# EAGLE design Adafruit 1.9in 320x170 Color IPS TFT (EAGLE 9.6.2)
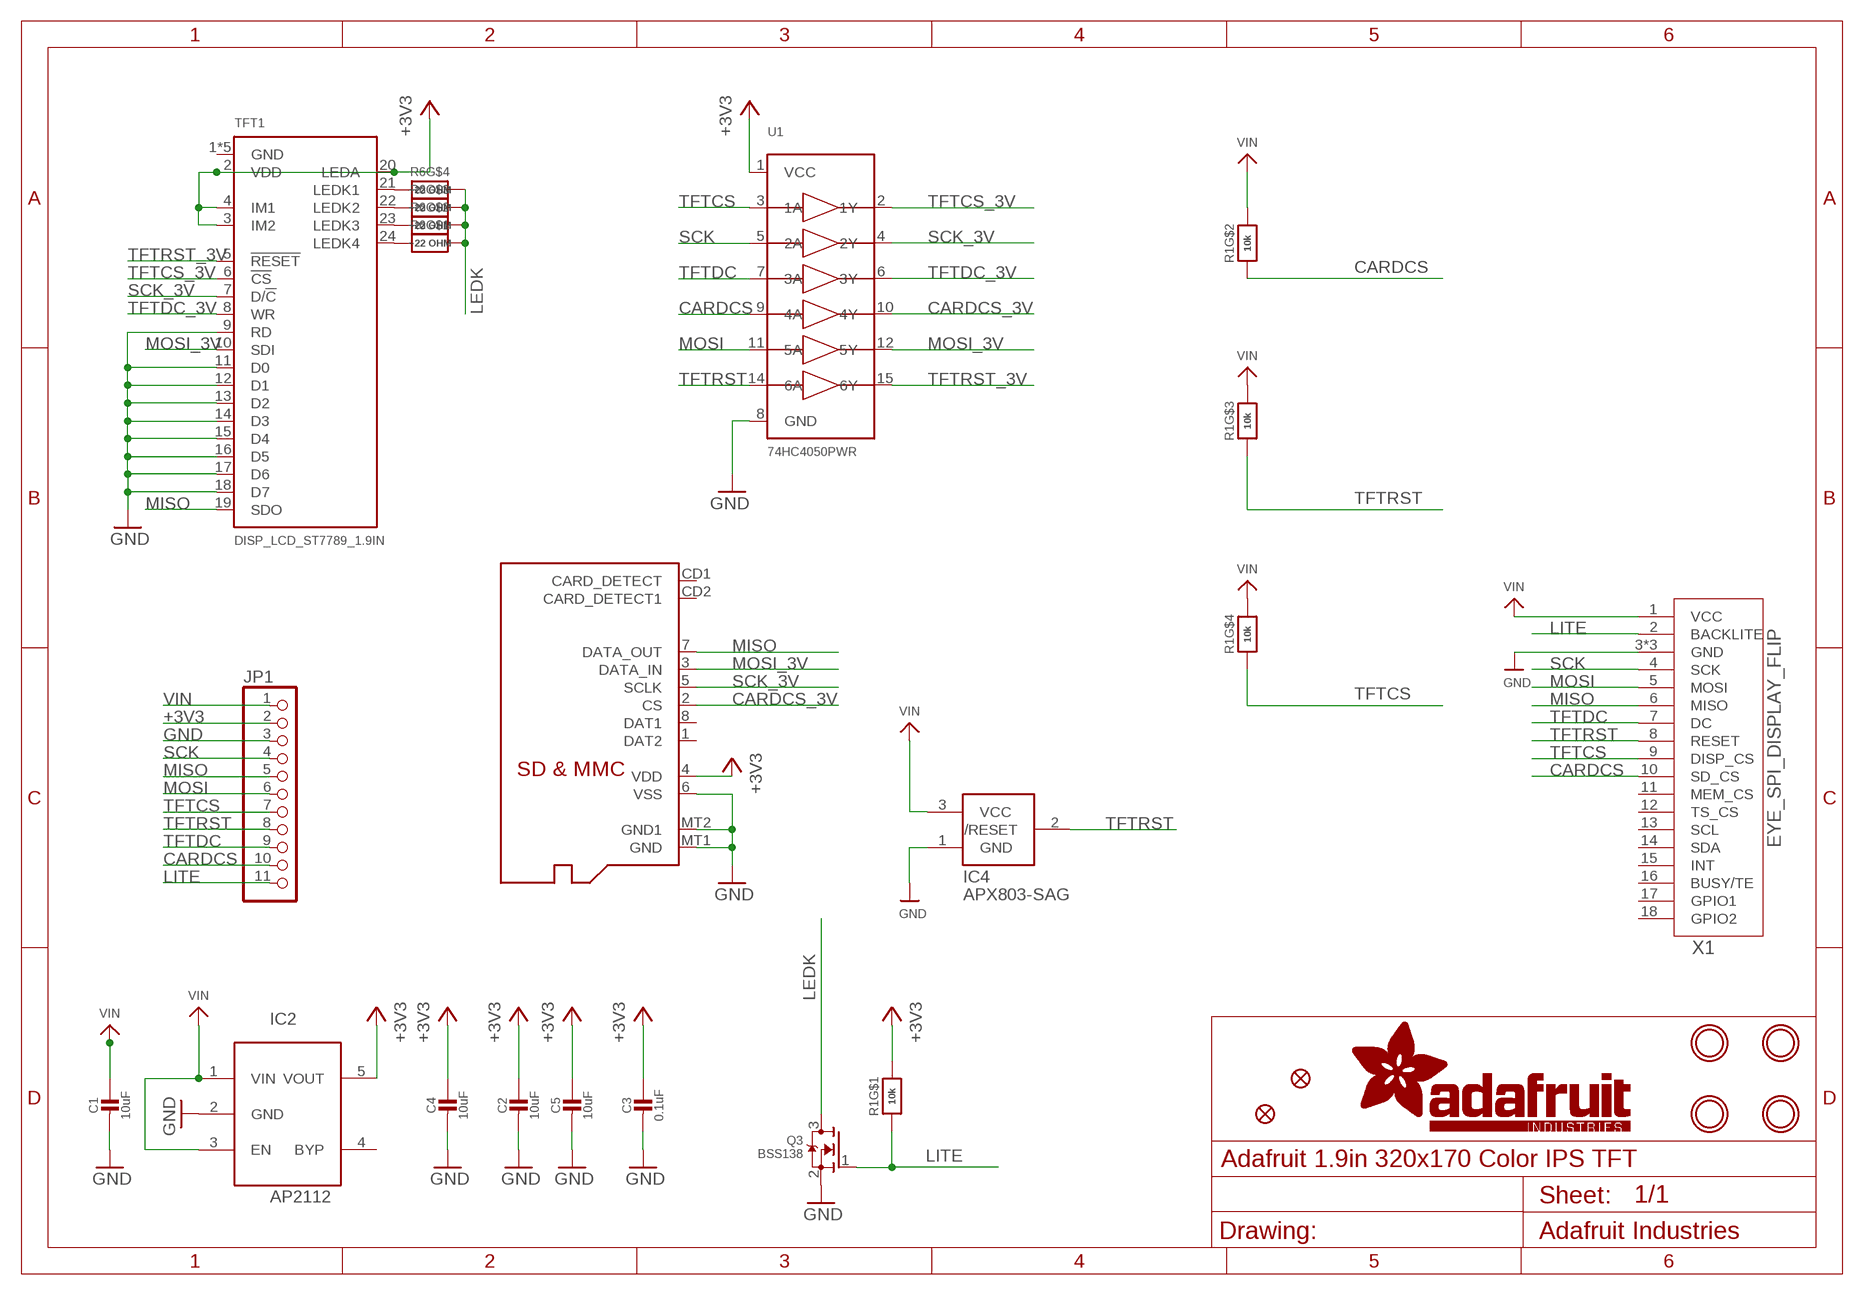
[diagram p0: schematic, sheet 1]

## Parts
C1  10uF  CAP_CERAMIC0805-NOOUTLINE  [0805-NO]
C2  10uF  CAP_CERAMIC0805-NOOUTLINE  [0805-NO]
C3  0.1uF  CAP_CERAMIC0603_NO  [0603-NO]
C4  10uF  CAP_CERAMIC0805-NOOUTLINE  [0805-NO]
C5  10uF  CAP_CERAMIC0805-NOOUTLINE  [0805-NO]
IC2  AP2112  LP298XS  [SOT23-5L]
IC4  APX803-SAG  AXP083-SAG  [SOT23]
JP1  HEADER-1X1176MIL  [1X11_ROUND_76]
Q2  MICROSD  [MICROSD]
Q3  BSS138  MOSFET-NWIDE  [SOT23-WIDE]
R1  10k  RESISTOR_4PACK  [RESPACK_4X0603]
R6  ~22 OHM  RESISTOR_4PACK  [RESPACK_4X0603]
TFT1  DISP_LCD_ST7789_1.9IN  [TFT_1.9IN_170X320_30P]
U1  74HC4050PWR  74HC4050DTSSOP  [TSSOP16]
U$4  FIDUCIAL_1MM  [FIDUCIAL_1MM]
U$5  FIDUCIAL_1MM  [FIDUCIAL_1MM]
U$7  MOUNTINGHOLE2.5  [MOUNTINGHOLE_2.5_PLATED]
U$8  MOUNTINGHOLE2.5  [MOUNTINGHOLE_2.5_PLATED]
U$9  MOUNTINGHOLE2.5  [MOUNTINGHOLE_2.5_PLATED]
U$10  MOUNTINGHOLE2.5  [MOUNTINGHOLE_2.5_PLATED]
X1  EYE_SPI_DISPLAY_FLIP  [EYE_SPI_DISPLAY_BOTCONTACT]

## Nets
+3V3 [power]: C2.1 C3.1 C4.1 C5.1 IC2.5(VOUT) JP1.2 Q2.4(VDD) R1.8 TFT1.2(VDD) TFT1.3(IM2) TFT1.4(IM1) TFT1.20(LEDA) U1.1(VCC)
CARDCS: JP1.10 R1.2 U1.9(4A) X1.10(SD_CS)
CARDCS_3V: Q2.2(CS) U1.10(4Y)
GND: C1.2 C2.2 C3.2 C4.2 C5.2 IC2.2(GND) IC4.1(GND) JP1.3 Q2.6(VSS) Q2.MT1(GND) Q2.MT2(GND1) Q3.2(S) TFT1.9(RD) TFT1.11(D0) TFT1.12(D1) TFT1.13(D2) TFT1.14(D3) TFT1.15(D4) TFT1.16(D5) TFT1.17(D6) TFT1.18(D7) U1.8(GND) X1.3(GND) X1.SUPPORT1(GND) X1.SUPPORT2(GND)
LEDK: Q3.3(D) R6.5 R6.6 R6.7 R6.8
LITE: JP1.11 Q3.1(G) R1.1 X1.2(BACKLITE)
MISO: JP1.5 Q2.7(DATA_OUT) TFT1.19(SDO) X1.6(MISO)
MOSI: JP1.6 U1.11(5A) X1.5(MOSI)
MOSI_3V: Q2.3(DATA_IN) TFT1.10(SDI) U1.12(5Y)
N$2: R6.4 TFT1.21(LEDK1)
N$3: R6.3 TFT1.22(LEDK2)
N$4: R6.2 TFT1.23(LEDK3)
N$5: R6.1 TFT1.24(LEDK4)
SCK: JP1.4 U1.5(2A) X1.4(SCK)
SCK_3V: Q2.5(SCLK) TFT1.7(D/!C) U1.4(2Y)
TFTCS: JP1.7 R1.4 U1.3(1A) X1.9(DISP_CS)
TFTCS_3V: TFT1.6(!CS) U1.2(1Y)
TFTDC: JP1.9 U1.7(3A) X1.7(DC)
TFTDC_3V: TFT1.8(WR) U1.6(3Y)
TFTRST: IC4.2(/RESET) JP1.8 R1.3 U1.14(6A) X1.8(RESET)
TFTRST_3V: TFT1.5(!RESET) U1.15(6Y)
VIN [power]: C1.1 IC2.1(VIN) IC2.3(EN) IC4.3(VCC) JP1.1 R1.5 R1.6 R1.7 X1.1(VCC)
Unconnected: IC2.4(BYP) Q2.1(DAT2) Q2.8(DAT1) Q2.CD1(CARD_DETECT) Q2.CD2(CARD_DETECT1) X1.11(MEM_CS) X1.12(TS_CS) X1.13(SCL) X1.14(SDA) X1.15(INT) X1.16(BUSY/TE) X1.17(GPIO1) X1.18(GPIO2)

## Power pins joined to a net without a drawn wire
GND: TFT1.1(GND) TFT1.25(GND) TFT1.30(GND) TFT1.MNT1(GND) TFT1.MNT2(GND)

## Library data of the parts
C1-C5 = microbuilder:CAP_CERAMIC: Ceramic Capacitors For new designs, use the packages preceded by an '_' character since they are more reliable: The following footprints should be used on most boards: _0402 - Standard footprint for regular board layouts _0603 - Standard footprint for regular board layouts _0805 - Standard footprint for regular board layouts _1206 - Standard footprint for regular board layouts For extremely tight-pitch boards where space is at a premium, the following 'micro-pitch' footprints can be used (smaller pads, no silkscreen outline, etc.): _0402MP - Micro-pitch footprint for very dense/compact boards _0603MP - Micro-pitch footprint for very dense/compact boards _0805MP - Micro-pitch footprint for very dense/compact boards _1206MP - Micro-pitch footprint for very dense/compact boards
IC2 = adafruit:LP298X
IC4 = adafruit:AXP083
JP1 = microbuilder:HEADER-1X11
Q2 = adafruit:MICROSD: Micro-SD / Transflash card holder with SPI pinout For the 3M # 2908-05WB-MG and/or 4UCON #19656 push-push type
Q3 = microbuilder:MOSFET-N: N-Channel Mosfet LEGEND VDS: Voltage Drain-Source ID: Drain Current RDS(ON): Drain-Source On-State Resistance VGS(TH): Gate-Source Threshold Voltage CISS: Drain-Source Input Capacitance SOT-23 Name VDS ID RDS(ON) VGS(TH) CISS Order Number 2N7002E 60V 260mA 2.5 Ohm 2.5V @ 250uA 26.7pF @ 25V 2N7002ET1GOSTR-ND BSH103 30V 850mA 400 mOhm 400mV @ 1mA 83pF @ 24V BSH103,235-ND BSS138 60V 320mA 1.6 Ohm 1.5V @ 250uA 50pF @ 10V Mouser: 771-BSS138PW115 DMN2075U-7 20V 4.2A 38 mOhm 1V @ 250 uA 594.3pF @ 10V DMN2075U-7DICT-ND * BSS138 good choice for I2C level-shifting POWERPAK 1212-8 Name VDS ID RDS(ON) VGS(TH) CISS Order Number Si7308DN 60V 6A 58 mOhm 3V @ 250uA 665pF @ 15V SI7308DN-T1-E3CT-ND
R1 R6 = microbuilder:RESISTOR_4PACK: Resistor Packs (4 resistors) 4 x 0603 10K 1/16W - Digikey: YC164J-10KCT-ND
TFT1 = adafruit_display:DISP_LCD_ST7789_1.9IN
U1 = microbuilder:74HC4050D: 6-channel level shifter 74HC4050D - 2V-6V Supply SOIC16 Digikey: 74HC4050D,653-ND Mouser: 771-74HC4050D-T TSSOP16 Digikey: 296-9215-1-ND Mouser:
U$4 U$5 = microbuilder:FIDUCIAL: Fiducial Alignment Points Various fiducial points for machine vision alignment.; BOM: EXCLUDE
U$7-U$10 = microbuilder:MOUNTINGHOLE: Mounting Hole For #2 screws (0.086"/2.18mm width, 0.094"/2.4mm hole) use 2.5mm; BOM: EXCLUDE
X1 = adafruit_display:EYE_SPI_DISPLAY

## Net classes
1 power: width 0.254 mm

## Board
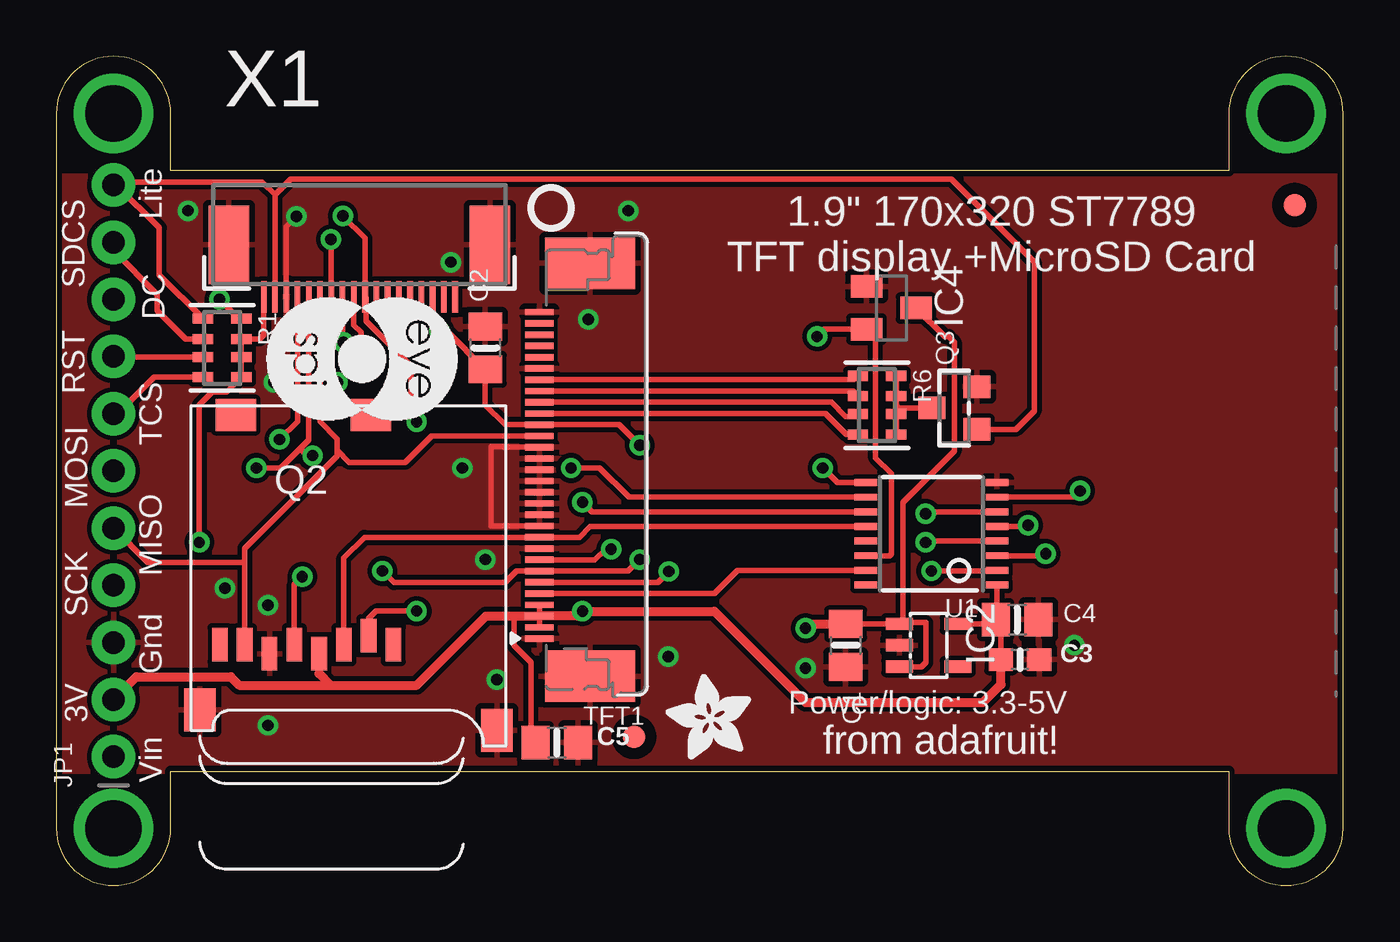
[diagram p1: board, top side]
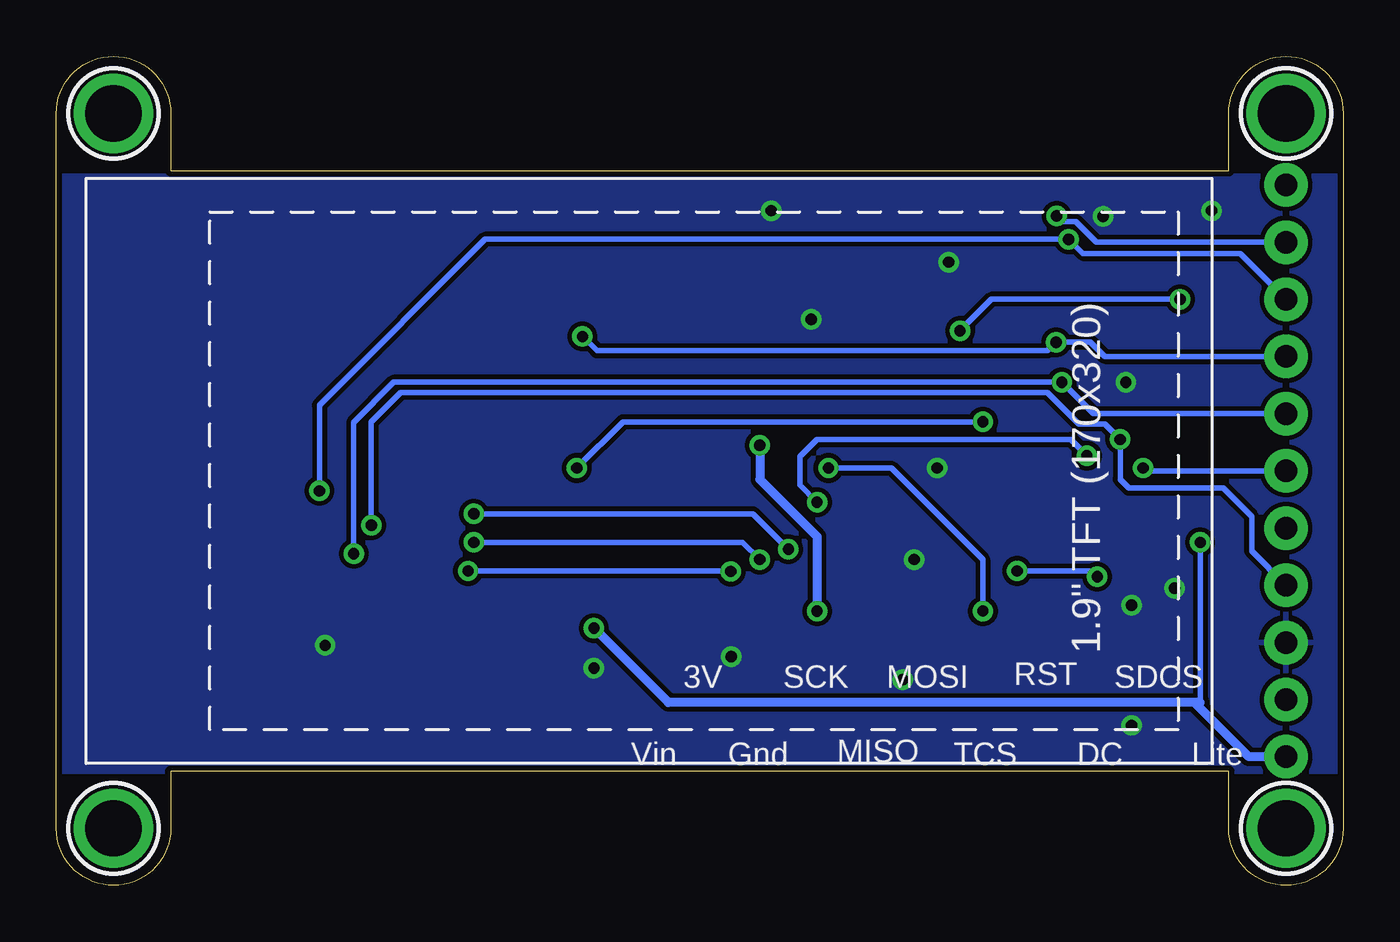
[diagram p2: board, bottom side, seen from below]

Size 57.15 x 36.83 mm. Coordinates in mm from the lower left corner, seen from the top.
Outline: 54.61,36.83 arc90 52.07,34.29 52.07,31.75 5.08,31.75 5.08,34.29 arc90 2.54,36.83 arc90 0,34.29 0,2.54 arc90 2.54,0 arc90 5.08,2.54 5.08,5.08 52.07,5.08 52.07,2.54 arc90 54.61,0 arc90 57.15,2.54 57.15,34.29 arc90 54.61,36.83
Copper layers (1*16): Top 0.035mm / dielectric 1.5mm / Bottom 0.035mm
Design rules "adafruit *": minimum track width 8mil, minimum drill 15.5mil, track to track 8mil, track to pad 8mil, pad to pad 8mil, via to via 8mil, smd to smd 8mil, copper to edge 10mil, drill to drill 8mil, minimum pad ring 10mil, minimum via ring 8mil, stop-mask expansion 2mil, vias tented up to drill 20mil, thermal gap 10mil

### Footprints (pad centres in the part's own frame; a part is rotated, then mirrored left to right if it is on the bottom)
0805-NO = smd 1.24 x 1.5: 1 -0.95,0; 2 0.95,0
0603-NO = smd 1.075 x 1: 1 -0.85,0; 2 0.85,0
SOT23-5L = smd 0.55 x 1.2: 1 -0.95,-1.3; 2 0,-1.3; 3 0.95,-1.3; 4 0.95,1.3; 5 -0.95,1.3
SOT23 = smd 1 x 1.4: 1 -0.95,-1.1; 2 0.95,-1.1; 3 0,1.1
1X11_ROUND_76 = drill 1 pad 1.93: 1 -12.7,0; 2 -10.16,0; 3 -7.62,0; 4 -5.08,0; 5 -2.54,0; 6 0,0; 7 2.54,0; 8 5.08,0; 9 7.62,0; 10 10.16,0; 11 12.7,0
MICROSD = smd 0.7 x 1.5: 1 9,-10.64; 2 7.9,-10.24; 3 6.8,-10.64; 4 5.7,-11.04; 5 4.6,-10.64; 6 3.5,-11.04; 7 2.4,-10.64; 8 1.3,-10.64 | smd 1.8 x 1.4: CD1 2,-0.44; CD2 8,-0.44 | smd 1.4 x 1.9: MT1 0.4,-13.54; MT2 13.6,-14.44
SOT23-WIDE = smd 1 x 1.2: 1 -0.95,-1; 2 0.95,-1; 3 0,1
RESPACK_4X0603 = smd 0.45 x 0.9: 1 -1.3,-0.85; 2 -0.4,-0.85; 3 0.4,-0.85; 4 1.3,-0.85; 5 1.3,0.85; 6 0.4,0.85; 7 -0.4,0.85; 8 -1.3,0.85
TFT_1.9IN_170X320_30P = smd 0.28 x 1.25: 1 -7.45,7.378; 2 -6.95,7.378; 3 -6.45,7.378; 4 -5.95,7.378; 5 -5.45,7.378; 6 -4.95,7.378; 7 -4.45,7.378; 8 -3.95,7.378; 9 -3.45,7.378; 10 -2.95,7.378; 11 -2.45,7.378; 12 -1.95,7.378; 13 -1.45,7.378; 14 -0.95,7.378; 15 -0.45,7.378; 16 0.05,7.378; 17 0.55,7.378; 18 1.05,7.378; 19 1.55,7.378; 20 2.05,7.378; 21 2.55,7.378; 22 3.05,7.378; 23 3.55,7.378; 24 4.05,7.378; 25 4.55,7.378; 26 5.05,7.378; 27 5.55,7.378; 28 6.05,7.378; 29 6.55,7.378; 30 7.05,7.378 | smd 2.3 x 4: MNT1 -9.12,5.122; MNT2 9.22,5.122
TSSOP16 = smd 0.305 x 0.991: 1 -2.275,-2.918; 2 -1.625,-2.918; 3 -0.975,-2.918; 4 -0.325,-2.918; 5 0.325,-2.918; 6 0.975,-2.918; 7 1.625,-2.918; 8 2.275,-2.918; 9 2.275,2.918; 10 1.625,2.918; 11 0.975,2.918; 12 0.325,2.918; 13 -0.325,2.918; 14 -0.975,2.918; 15 -1.625,2.918; 16 -2.275,2.918
FIDUCIAL_1MM = smd 1 x 1: 1 0,0
MOUNTINGHOLE_2.5_PLATED = drill 2.5 pad 3.2: P$1 0,0
EYE_SPI_DISPLAY_BOTCONTACT = smd 0.25 x 1.4: 1 -4.25,-2.678; 2 -3.75,-2.678; 3 -3.25,-2.678; 4 -2.75,-2.678; 5 -2.25,-2.678; 6 -1.75,-2.678; 7 -1.25,-2.678; 8 -0.75,-2.678; 9 -0.25,-2.678; 10 0.25,-2.678; 11 0.75,-2.678; 12 1.25,-2.678; 13 1.75,-2.678; 14 2.25,-2.678; 15 2.75,-2.678; 16 3.25,-2.678; 17 3.75,-2.678; 18 4.25,-2.678 | smd 1.8 x 3.5: SUPPORT1 5.8,-0.372; SUPPORT2 -5.8,-0.372

### Placement (x,y rotation side)
C1  35.05,10.67 270 top
C2  19.05,23.88 90 top
C3  42.8,10.03 0 top
C4  42.67,11.81 0 top
C5  22.23,6.35 0 top
IC2  38.73,10.67 270 top
IC4  37.08,25.65 270 top
JP1  2.54,18.41 90 top
Q2  5.97,21.34 0 top
Q3  39.88,21.21 90 top
R1  7.37,23.88 270 top
R6  36.45,21.34 270 top
TFT1  28.83,18.41 90 top
U1  38.86,15.62 90 top
U$2  [PCBFEAT-REV-040]  21.97,30.1 180 top
U$4  54.99,30.23 180 top
U$5  25.65,6.6 270 top
U$7  54.61,2.54 0 bottom
U$8  54.61,34.29 0 bottom
U$9  2.54,2.54 0 bottom
U$10  2.54,34.29 0 bottom
U$21  [ADAFRUIT_3.5MM]  30.86,5.59 90 top
U$22  [EYESPI_MINI_LOGO]  9.27,26.16 270 top
X1  13.46,28.83 0 top

### Tracks (layer width: path | path; a pad name or v marks a point on that pad's centre or on a via)
+3V3  (via drill 0.5)
  Top 0.254: TFT1.4 TFT1.3 TFT1.2 | U1.1 41.78,11.87 C4.1 | C4.1 41.53,11.62 IC2.5 | C4.1 41.95,11.58 C3.1 | Q2.4 11.67,9.41 | v25.91,19.56 25,20.46 TFT1.20 19.92,20.46 19.05,21.34 C2.1 17.34,24.64 v17.02,24.64 | R1.8 8.1,25.18 v7.24,26.03 | 20.32,11.96 20.32,10.67 21.08,9.91 21.08,6.54 C5.1
  Top 0.406: 11.67,9.41 12.19,8.89 | 12.19,8.89 16,8.89 19.08,11.96 20.32,11.96 TFT1.3 23.15,11.96 v23.37,12.18 29.22,12.18 33.27,8.13 41.15,8.13 41.95,8.93 C3.1 | JP1.2 3.56,9.27 7.75,9.27 8.13,8.89 12.19,8.89
  Bottom 0.254: v7.24,26.03 15.62,26.03 v17.02,24.64
  Bottom 0.406: v25.91,19.56 25.91,18.03 23.37,15.49 v23.37,12.18
CARDCS  (via drill 0.5)
  Top 0.254: R1.2 5.75,24.28 4.48,25.55 4.48,26.25 2.54,28.19 JP1.10 | v12.72,29.74 13.71,28.75 X1.10 13.76,26.11 13.76,25.06 15.75,23.07 15.75,20.85 v16,20.59 | v34.04,18.54 34.68,17.9 U1.9
  Bottom 0.254: v12.72,29.74 12.47,29.48 11.87,29.48 10.96,28.58 JP1.10 | v16,20.59 31.98,20.59 v34.04,18.54
CARDCS_3V  (via drill 0.5)
  Top 0.254: U1.10 25.43,17.25 24.13,18.54 v22.86,18.54 | v16,12.19 14.2,12.19 13.87,11.86 Q2.2
  Bottom 0.254: v22.86,18.54 20.07,18.54 16,14.48 v16,12.19
GND  (via drill 0.5)
  Top 0.254: X1.3 10.21,29.26 v10.67,29.72 | TFT1.18 19.81,19.46 19.81,19.51 19.3,19.51 19.3,15.96 TFT1.11
  other vias: 9.4,12.45 9.4,7.11 9.65,22.35 17.53,27.69 23.62,25.15 5.84,29.97 25.4,29.97 45.21,10.67 33.27,9.65 18.03,18.54 19.05,14.48 27.18,10.16 19.56,9.14 7.49,13.21
  pour Top: 57.15,31.5 57.15,5.08 0,5.08 0,31.5
  pour Bottom: 57.15,31.5 57.15,5.08 0,5.08 0,31.5
LEDK
  Top 0.254: R6.8 R6.7 37.3,21.34 | 37.3,21.34 R6.6 R6.5 | Q3.3 37.43,21.21 37.3,21.34
LITE
  Top 0.254: R1.1 4.57,27.12 4.57,29.21 2.67,31.12 JP1.11 2.67,31.24 9.14,31.24 9.71,30.67 | X1.2 9.71,30.67 | 9.71,30.67 10.41,31.37 39.75,31.37 43.43,27.69 43.43,21.08 42.61,20.26 Q3.1
MISO
  Top 0.254: X1.6 11.71,20.6 12.47,19.84 12.47,19.33 | 12.47,19.33 12.47,19.08 8.37,14.97 8.37,14.35 | 8.37,14.35 Q2.7 | 8.37,14.35 4.06,14.35 JP1.5 | TFT1.19 16.66,19.96 15.49,18.8 13.01,18.8 12.47,19.33
MOSI  (via drill 0.5)
  Top 0.254: X1.5 11.21,19.79 10.83,19.4 | v8.89,18.54 9.97,18.54 10.83,19.4 | U1.11 23.79,16.6 v23.37,17.02 | v11.38,19.1 11.13,19.1 10.83,19.4
  Bottom 0.254: v8.89,18.54 8.76,18.41 JP1.6 | v23.37,17.02 24.13,17.78 24.13,19.05 23.37,19.81 12.1,19.81 v11.38,19.1
MOSI_3V
  Top 0.254: Q2.3 12.77,14.55 13.69,15.46 TFT1.10 23.23,15.46 23.71,15.95 U1.12
N$2
  Top 0.254: TFT1.21 34.15,20.96 35.08,20.04 R6.4
N$3
  Top 0.254: TFT1.22 34.41,21.47 35.05,20.83 35.49,20.83 R6.3
N$4
  Top 0.254: TFT1.23 35.37,21.97 R6.2
N$5
  Top 0.254: TFT1.24 35.43,22.47 R6.1
SCK  (via drill 0.5)
  Top 0.254: X1.4 10.71,20.62 v9.91,19.81 | v43.16,16 43.1,15.95 U1.5
  Bottom 0.254: JP1.4 4.06,14.86 4.06,16.38 5.33,17.65 9.53,17.65 9.91,18.03 v9.91,19.81 10.59,20.5 11.75,20.5 13.15,21.9 41.86,21.9 43.16,20.59 v43.16,16
SCK_3V  (via drill 0.5)
  Top 0.254: Q2.5 10.57,13.36 v10.92,13.72 | v14.48,13.97 14.99,13.46 19.93,13.46 20.43,13.96 TFT1.7 25.39,13.96 v25.91,14.48 | v38.61,15.24 38.66,15.3 U1.4
  Bottom 0.254: v10.92,13.72 11.18,13.97 v14.48,13.97 | v25.91,14.48 26.67,15.24 v38.61,15.24
TFTCS  (via drill 0.5)
  Top 0.254: JP1.7 2.74,20.95 4.36,22.58 R1.4 | X1.9 13.21,24.9 13.53,24.58 13.53,23.39 v12.49,22.35 | v43.94,14.73 43.86,14.65 U1.3
  Bottom 0.254: JP1.7 11.1,20.95 v12.49,22.35 42.16,22.35 43.94,20.57 v43.94,14.73
TFTCS_3V  (via drill 0.5)
  Top 0.254: TFT1.6 26.72,13.46 v27.2,13.95 | U1.2 41.75,13.97 v38.86,13.97
  Bottom 0.254: v27.2,13.95 27.22,13.97 v38.86,13.97
TFTDC  (via drill 0.5)
  Top 0.254: X1.7 12.21,28.68 v12.19,28.7 | v45.47,17.53 45.19,17.25 U1.7
  Bottom 0.254: JP1.9 4.57,28.07 11.56,28.07 v12.19,28.7 38.1,28.7 45.47,21.34 v45.47,17.53
TFTDC_3V  (via drill 0.5)
  Top 0.254: TFT1.8 23.91,14.46 24.38,14.94 v24.64,14.94 | v38.61,16.51 38.69,16.6 U1.6
  Bottom 0.254: v24.64,14.94 26.21,16.51 v38.61,16.51
TFTRST  (via drill 0.5)
  Top 0.254: R1.3 2.56,23.48 JP1.8 | X1.8 12.71,24.17 v12.75,24.13 | U1.14 37,14.65 37.08,14.73 37.08,18.29 36.38,18.99 36.38,24.31 IC4.2 34.1,24.7 v33.78,24.38
  Bottom 0.254: JP1.8 10.59,23.49 11.22,24.13 v12.75,24.13 13.13,23.75 33.15,23.75 v33.78,24.38
TFTRST_3V
  Top 0.254: TFT1.5 29.22,12.96 30.25,14 U1.15
VIN  (via drill 0.5)
  Top 0.254: X1.1 9.21,24.45 9.04,24.28 R1.7 R1.6 R1.5 7.57,21.93 6.93,21.93 6.35,21.34 v6.35,15.24 | IC2.1 C1.1 | IC2.3 38.42,9.72 38.61,9.91 38.61,11.68 37.5,11.68 IC2.1 | IC4.3 39.45,24.38 39.62,24.38 39.88,24.13 39.88,19.3 37.59,17.02 37.59,11.78 IC2.1
  Top 0.406: v33.27,11.43 33.46,11.62 C1.1
  Bottom 0.254: v6.35,15.24 6.35,8.13
  Bottom 0.406: JP1.1 4.19,5.71 6.6,8.13 | 6.35,8.13 6.6,8.13 | 6.6,8.13 29.97,8.13 v33.27,11.43

### Text on the board
tPlace: Lite | 1.9" 170x320 ST7789 / TFT display +MicroSD Card | SDCS | DC | RST | TCS | MOSI | MISO | SCK | Gnd | Power/logic: 3.3-5V | 3V | from adafruit! | Vin
bPlace: RST | MOSI | SCK | 3V | SDCS | Lite | DC | Gnd | Vin | TCS | MISO